# EAGLE design ENERGIS_DispBrd_Rack-PDU_1.1.0 (EAGLE 9.2.1)
VERSION: 1.1.0

## Sheet 1 of 3
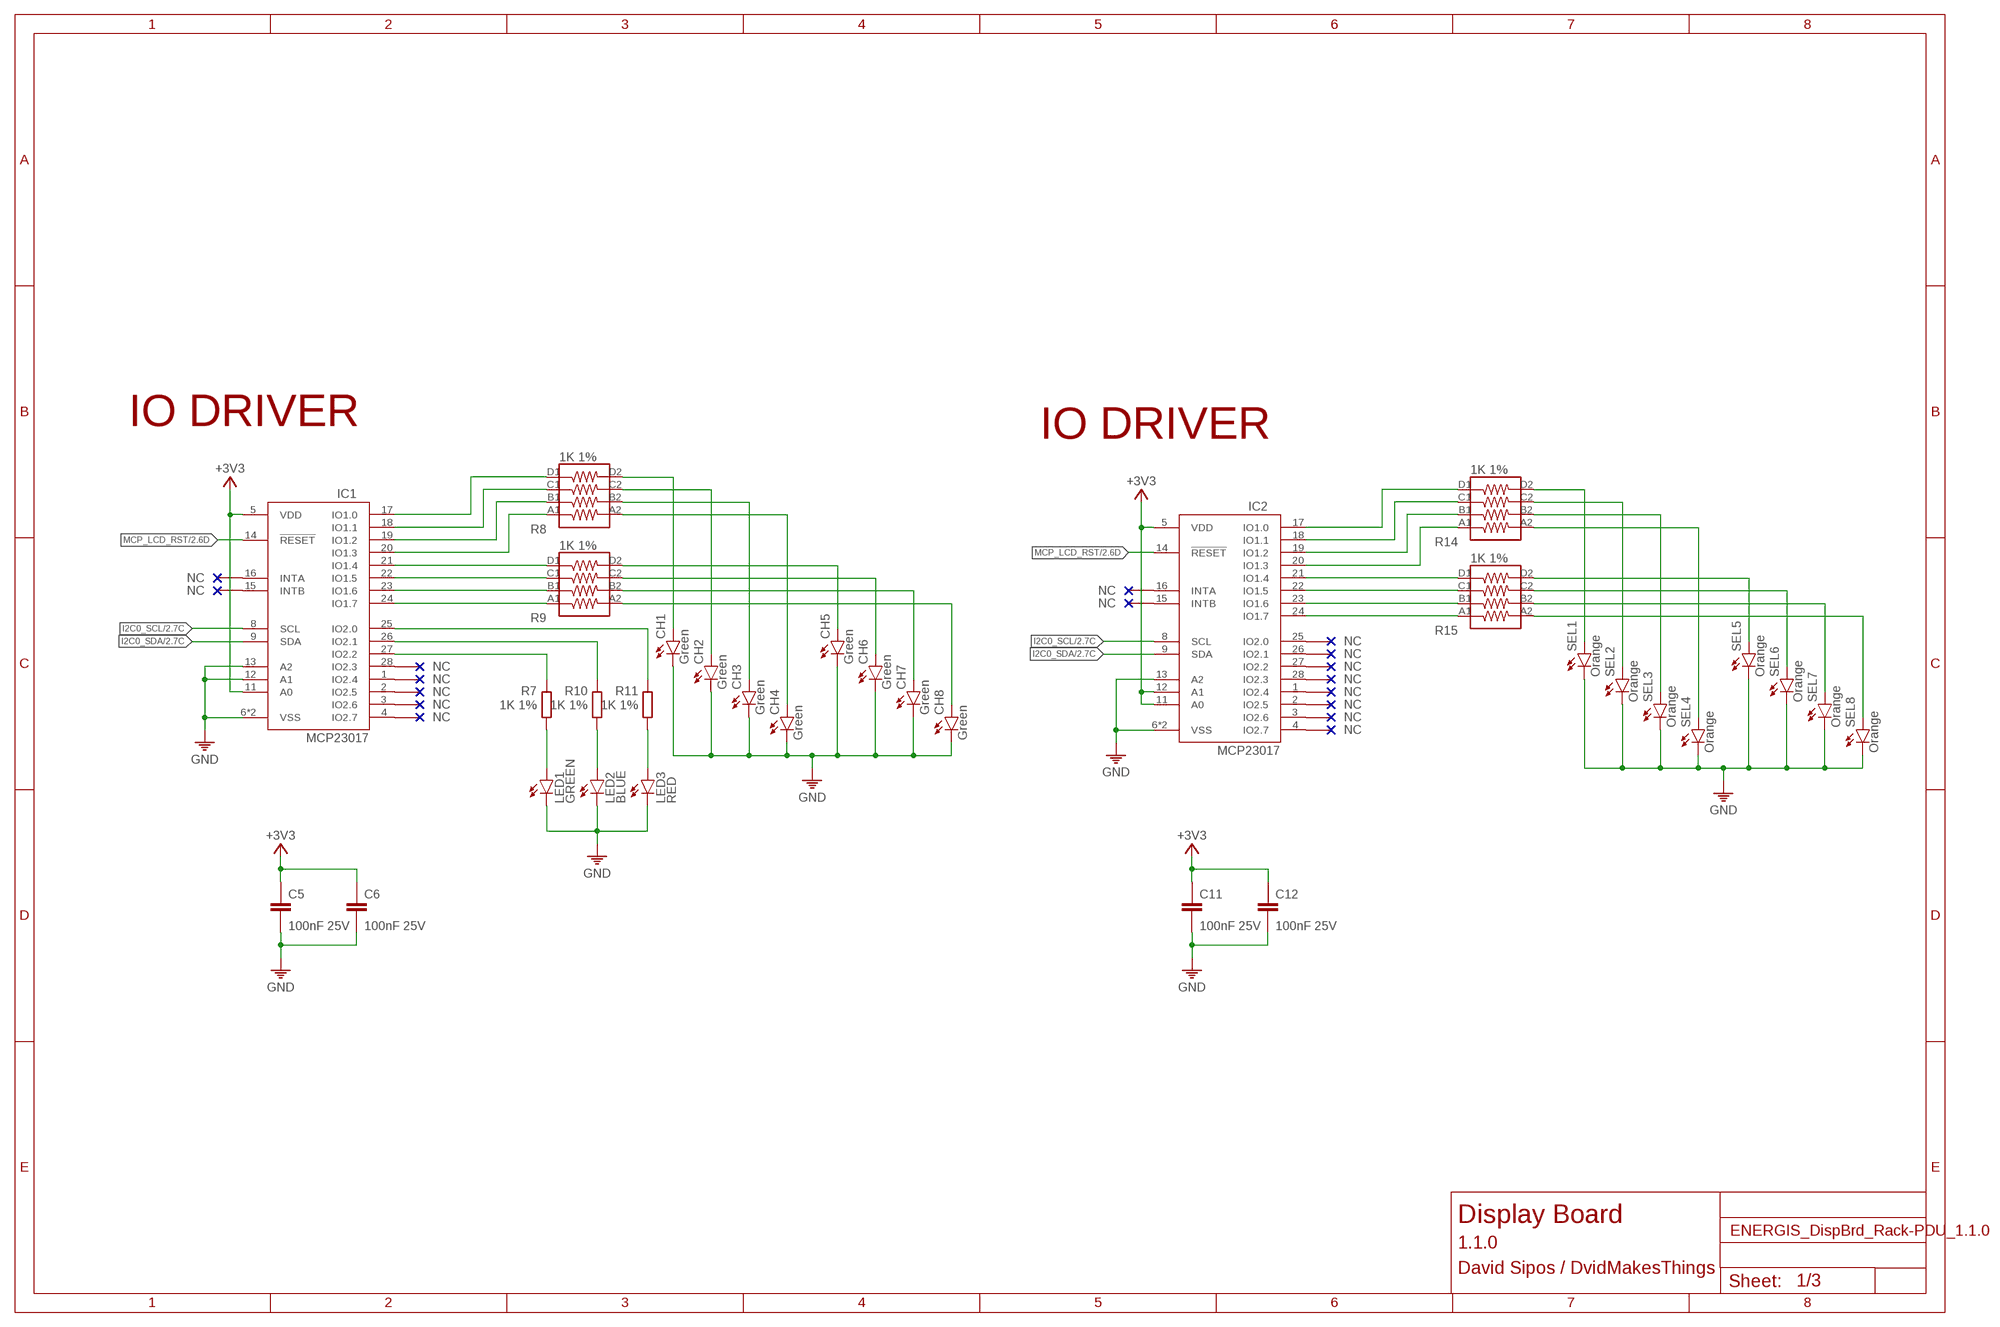
[diagram p0: schematic, sheet 1]

### Parts
C5  100nF 25V  100NF-25V-0402  [0402]
C6  100nF 25V  100NF-25V-0402  [0402]
C11  100nF 25V  100NF-25V-0402  [0402]
C12  100nF 25V  100NF-25V-0402  [0402]
CH1  Green  LED-GREENLED-0805  [LED-0805]
CH2  Green  LED-GREENLED-0805  [LED-0805]
CH3  Green  LED-GREENLED-0805  [LED-0805]
CH4  Green  LED-GREENLED-0805  [LED-0805]
CH5  Green  LED-GREENLED-0805  [LED-0805]
CH6  Green  LED-GREENLED-0805  [LED-0805]
CH7  Green  LED-GREENLED-0805  [LED-0805]
CH8  Green  LED-GREENLED-0805  [LED-0805]
IC1  MCP23017T-E/ML  MCP23017-E/ML  [QFN28[6X6]ML]
IC2  MCP23017T-E/ML  MCP23017-E/ML  [QFN28[6X6]ML]
LED1  GREEN  LED-GREEN3MM-CLEAR  [LED3MM]
LED2  BLUE  LED-BLUE3MM-CLEAR  [LED3MM]
LED3  RED  LED-RED3MM-CLEAR  [LED3MM]
R7  1K 1%  1K-1%0402  [0402]
R8  1K 1%  1K-1%_ARRAY0603X4-1206  [_0603X4-1206]
R9  1K 1%  1K-1%_ARRAY0603X4-1206  [_0603X4-1206]
R10  1K 1%  1K-1%0402  [0402]
R11  1K 1%  1K-1%0402  [0402]
R14  1K 1%  1K-1%_ARRAY0603X4-1206  [_0603X4-1206]
R15  1K 1%  1K-1%_ARRAY0603X4-1206  [_0603X4-1206]
SEL1  Orange  LED-ORANGELED-0805  [LED-0805]
SEL2  Orange  LED-ORANGELED-0805  [LED-0805]
SEL3  Orange  LED-ORANGELED-0805  [LED-0805]
SEL4  Orange  LED-ORANGELED-0805  [LED-0805]
SEL5  Orange  LED-ORANGELED-0805  [LED-0805]
SEL6  Orange  LED-ORANGELED-0805  [LED-0805]
SEL7  Orange  LED-ORANGELED-0805  [LED-0805]
SEL8  Orange  LED-ORANGELED-0805  [LED-0805]

### Nets
+3V3: C5.1 C6.1 C11.1 C12.1 IC1.5(VDD) IC1.11(A0) IC2.5(VDD) IC2.11(A0) IC2.12(A1) ; also sheet 2,3
GND: C5.2 C6.2 C11.2 C12.2 CH1.C CH2.C CH3.C CH4.C CH5.C CH6.C CH7.C CH8.C IC1.6(VSS) IC1.12(A1) IC1.13(A2) IC1.PAD(VSS) IC2.6(VSS) IC2.13(A2) IC2.PAD(VSS) LED1.K(C) LED2.K(C) LED3.K(C) SEL1.C SEL2.C SEL3.C SEL4.C SEL5.C SEL6.C SEL7.C SEL8.C ; also sheet 2,3
I2C0_SCL: IC1.8(SCL) IC2.8(SCL) ; also sheet 2
I2C0_SDA: IC1.9(SDA) IC2.9(SDA) ; also sheet 2
MCP_LCD_RST: IC1.14(!RESET) IC2.14(!RESET) ; also sheet 2
N$8: IC2.17(IO1.0) R14.D1
N$9: IC2.18(IO1.1) R14.C1
N$10: IC2.19(IO1.2) R14.B1
N$11: IC2.20(IO1.3) R14.A1
N$12: IC2.21(IO1.4) R15.D1
N$13: IC2.22(IO1.5) R15.C1
N$14: IC2.23(IO1.6) R15.B1
N$15: IC2.24(IO1.7) R15.A1
N$16: R14.D2 SEL1.A
N$17: R14.C2 SEL2.A
N$18: R14.B2 SEL3.A
N$19: R14.A2 SEL4.A
N$20: R15.D2 SEL5.A
N$21: R15.C2 SEL6.A
N$22: R15.B2 SEL7.A
N$23: R15.A2 SEL8.A
N$46: IC1.26(IO2.1) R10.1
N$47: IC1.27(IO2.2) R7.1
N$48: IC1.25(IO2.0) R11.1
N$50: IC1.17(IO1.0) R8.D1
N$51: IC1.18(IO1.1) R8.C1
N$52: IC1.19(IO1.2) R8.B1
N$53: IC1.20(IO1.3) R8.A1
N$54: IC1.21(IO1.4) R9.D1
N$55: IC1.22(IO1.5) R9.C1
N$56: IC1.23(IO1.6) R9.B1
N$57: IC1.24(IO1.7) R9.A1
N$58: CH1.A R8.D2
N$59: CH2.A R8.C2
N$60: CH3.A R8.B2
N$61: CH4.A R8.A2
N$62: CH5.A R9.D2
N$63: CH6.A R9.C2
N$64: CH7.A R9.B2
N$65: CH8.A R9.A2
N$66: LED3.A R11.2
N$67: LED2.A R10.2
N$68: LED1.A R7.2
Unconnected: IC1.1(IO2.4) IC1.2(IO2.5) IC1.3(IO2.6) IC1.4(IO2.7) IC1.15(INTB) IC1.16(INTA) IC1.28(IO2.3) IC2.1(IO2.4) IC2.2(IO2.5) IC2.3(IO2.6) IC2.4(IO2.7) IC2.15(INTB) IC2.16(INTA) IC2.25(IO2.0) IC2.26(IO2.1) IC2.27(IO2.2) IC2.28(IO2.3)

### Notes on the sheet
- IO DRIVER | IO DRIVER
- Display Board
- David Sipos / DvidMakesThings

## Sheet 2 of 3: CONNECTORS
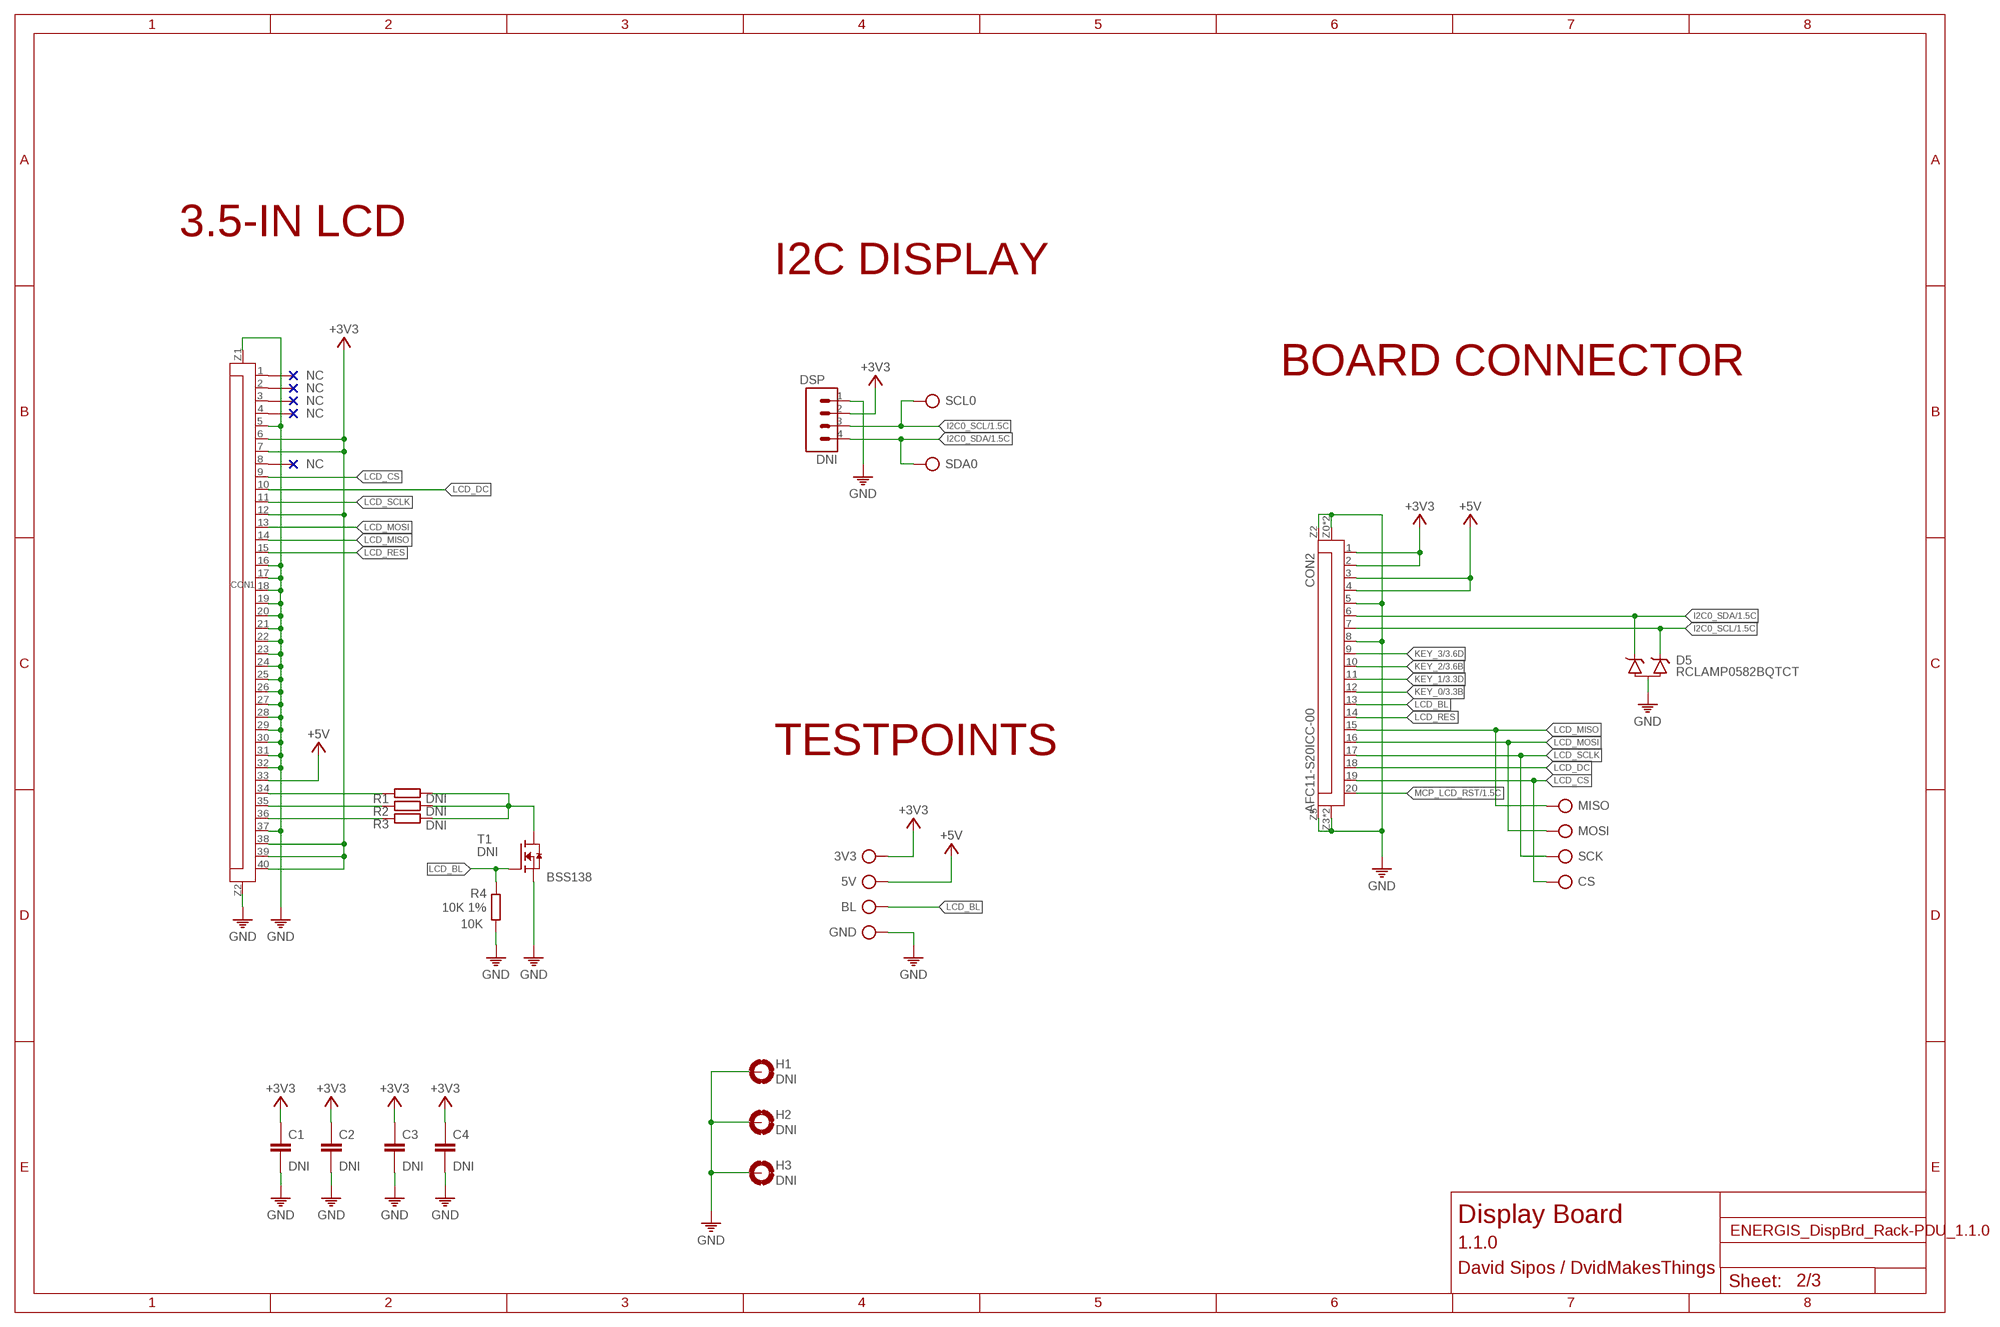
[diagram p1: schematic, sheet 2]

### Parts
3V3  DNI  TP-ROUND  [TP-ROUND]
5V  DNI  TP-ROUND  [TP-ROUND]
BL  DNI  TP-ROUND  [TP-ROUND]
C1  DNI  C-0402  [C0402]
C2  DNI  C-0402  [C0402]
C3  DNI  C-0402  [C0402]
C4  DNI  C-0402  [C0402]
CON1  DNI  FPC40-HD  [FPC40_3.5TFT]
CON2  AFC11-S20ICC-00  AFC11-S20ICC-00  [FPC20]
CS  DNI  TP-ROUND  [TP-ROUND]
D5  RCLAMP0582BQTCT  RCLAMP0582BQTCT-  [SC75]
DSP  DNI  CON-1X4  [1X4]
GND  DNI  TP-ROUND  [TP-ROUND]
H1  DNI  MOUNT-PAD-ROUND3.2  [3,2-PAD]
H2  DNI  MOUNT-PAD-ROUND3.2  [3,2-PAD]
H3  DNI  MOUNT-PAD-ROUND3.2  [3,2-PAD]
MISO  DNI  TP-ROUND  [TP-ROUND]
MOSI  DNI  TP-ROUND  [TP-ROUND]
R1  DNI  R0402  [0402]
R2  DNI  R0402  [0402]
R3  DNI  R0402  [0402]
R4  10K 1%  10K-1%0402  [0402]
SCK  DNI  TP-ROUND  [TP-ROUND]
SCL0  DNI  TP-ROUND  [TP-ROUND]
SDA0  DNI  TP-ROUND  [TP-ROUND]
T1  DNI  BSS138  [SOT23]

### Nets
+3V3: 3V3.TP C1.1 C2.1 C3.1 C4.1 CON1.6 CON1.7 CON1.12 CON1.38 CON1.39 CON1.40 CON2.1 CON2.2 DSP.2 ; also sheet 1,3
+5V: 5V.TP CON1.33 CON2.3 CON2.4
GND: C1.2 C2.2 C3.2 C4.2 CON1.5 CON1.16 CON1.17 CON1.18 CON1.19 CON1.20 CON1.21 CON1.22 CON1.23 CON1.24 CON1.25 CON1.26 CON1.27 CON1.28 CON1.29 CON1.30 CON1.31 CON1.32 CON1.37 CON1.Z1 CON1.Z2 CON2.5 CON2.8 CON2.Z0(Z1) CON2.Z1 CON2.Z2 CON2.Z3 CON2.Z4(Z3) CON2.Z5(Z4) D5.3 DSP.1 GND.TP H1.B3,2(MOUNT) H2.B3,2(MOUNT) H3.B3,2(MOUNT) R4.2 T1.2(S) ; also sheet 1,3
I2C0_SCL: CON2.7 D5.1 DSP.3 SCL0.TP ; also sheet 1
I2C0_SDA: CON2.6 D5.2 DSP.4 SDA0.TP ; also sheet 1
KEY_0: CON2.12 ; also sheet 3
KEY_1: CON2.11 ; also sheet 3
KEY_2: CON2.10 ; also sheet 3
KEY_3: CON2.9 ; also sheet 3
LCD_BL: BL.TP CON2.13 R4.1 T1.1(G)
LCD_CS: CON1.9 CON2.19 CS.TP
LCD_DC: CON1.10 CON2.18
LCD_MISO: CON1.14 CON2.15 MISO.TP
LCD_MOSI: CON1.13 CON2.16 MOSI.TP
LCD_RES: CON1.15 CON2.14
LCD_SCLK: CON1.11 CON2.17 SCK.TP
MCP_LCD_RST: CON2.20 ; also sheet 1
N$2: CON1.35 R2.2
N$3: CON1.36 R3.2
N$4: R1.1 R2.1 R3.1 T1.3(D)
N$5: CON1.34 R1.2
Unconnected: CON1.1 CON1.2 CON1.3 CON1.4 CON1.8

### Notes on the sheet
- 3.5-IN LCD
- I2C DISPLAY
- BOARD CONNECTOR
- TESTPOINTS
- BSS138
- 10K
- Display Board
- David Sipos / DvidMakesThings

## Sheet 3 of 3: PUSHBUTTONS
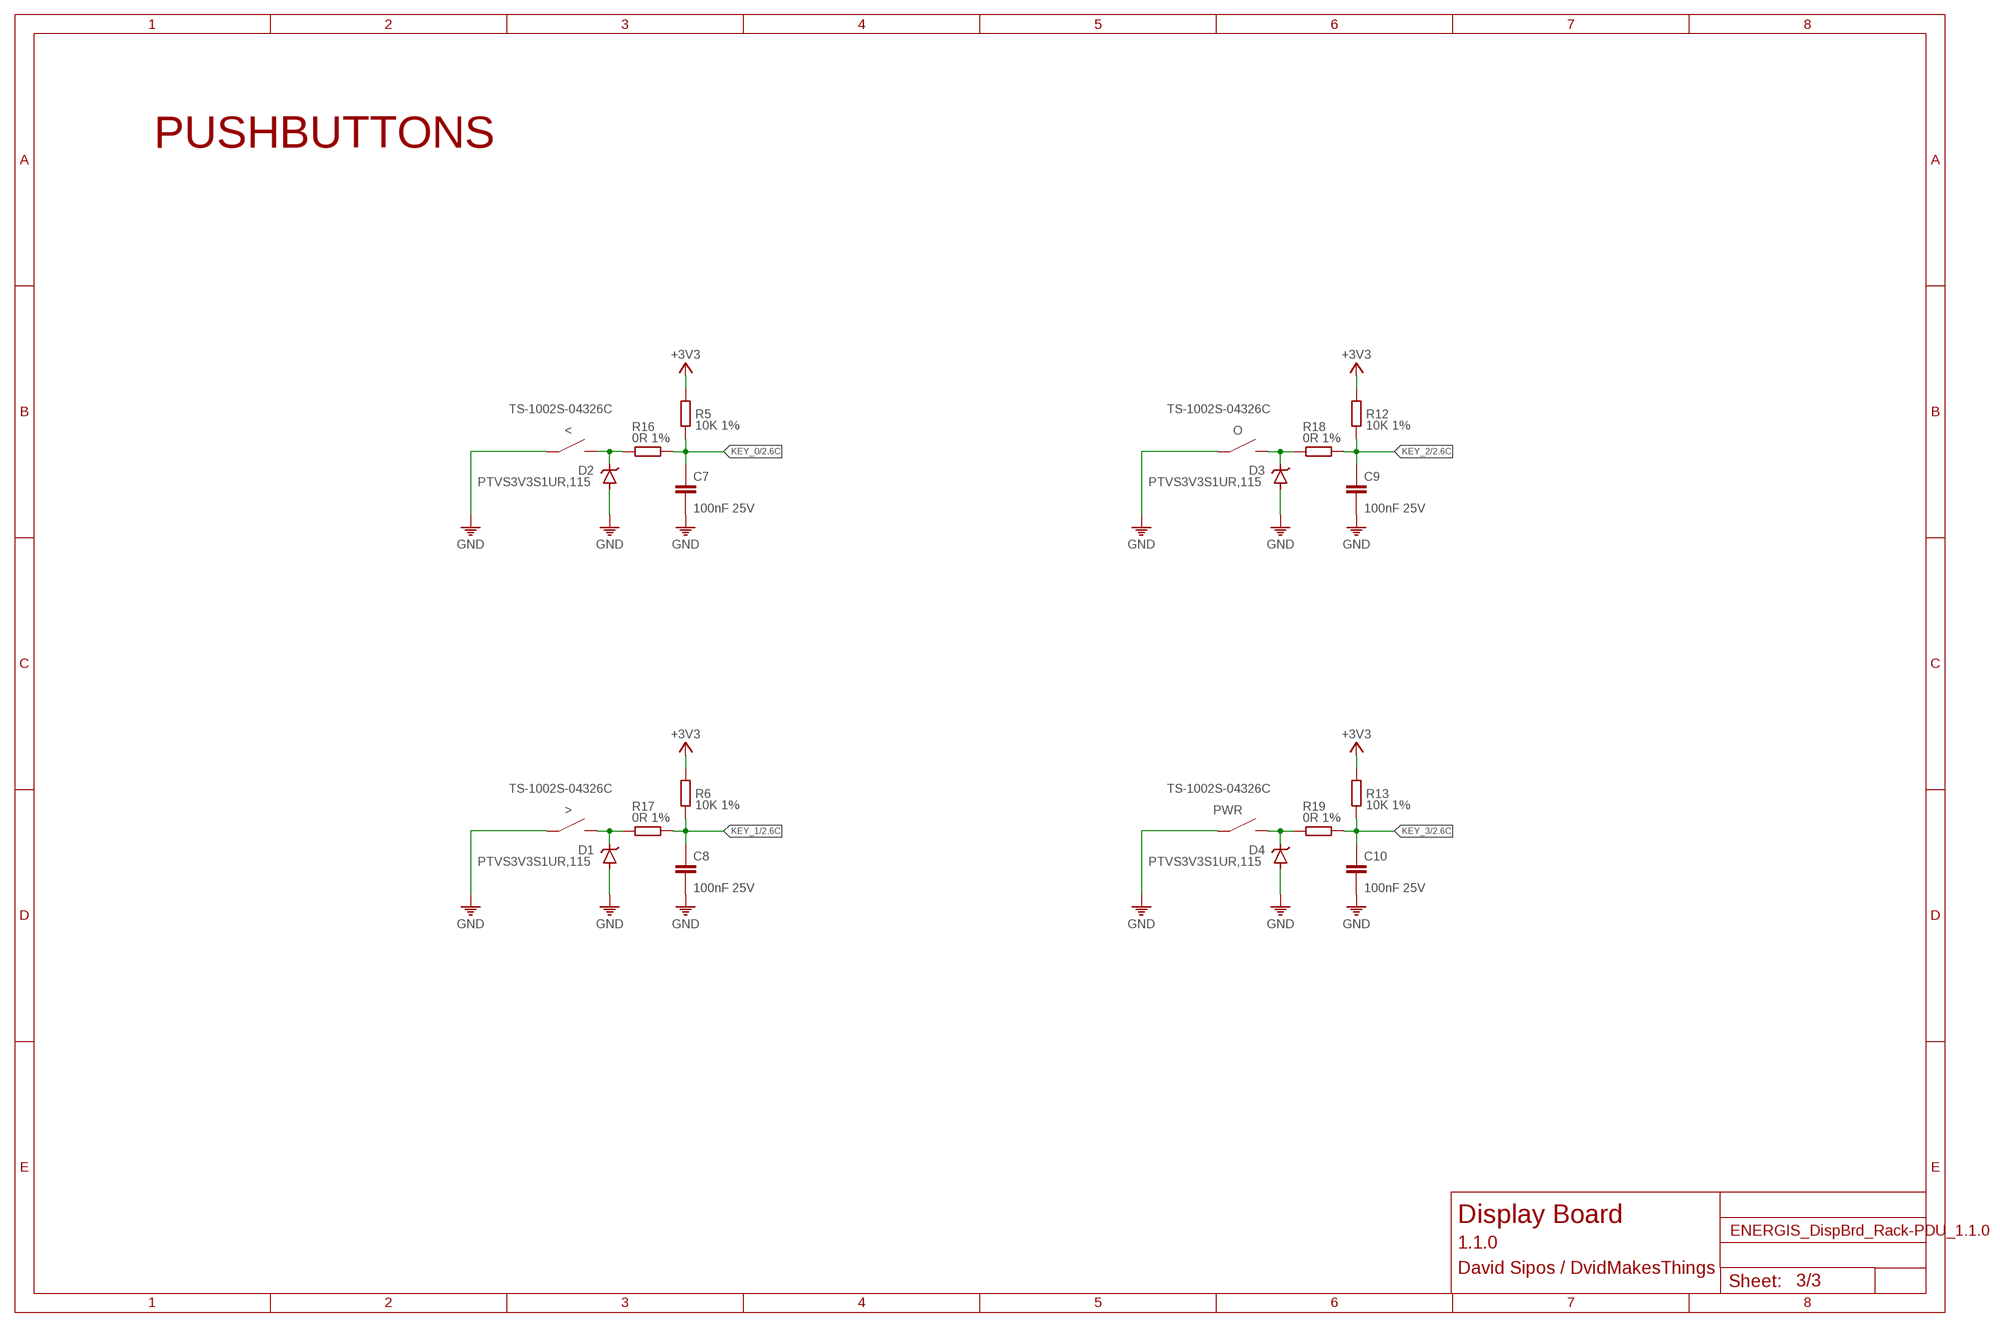
[diagram p2: schematic, sheet 3]

### Parts
<  TS-1002S-04326C  SWITCH6X6-SHORT  [PUSHBUTTON-6X6]
>  TS-1002S-04326C  SWITCH6X6-SHORT  [PUSHBUTTON-6X6]
C7  100nF 25V  100NF-25V-0402  [0402]
C8  100nF 25V  100NF-25V-0402  [0402]
C9  100nF 25V  100NF-25V-0402  [0402]
C10  100nF 25V  100NF-25V-0402  [0402]
D1  PTVS3V3S1UR,115  PTVS3V3S1UR,115  [SOD-123]
D2  PTVS3V3S1UR,115  PTVS3V3S1UR,115  [SOD-123]
D3  PTVS3V3S1UR,115  PTVS3V3S1UR,115  [SOD-123]
D4  PTVS3V3S1UR,115  PTVS3V3S1UR,115  [SOD-123]
O  TS-1002S-04326C  SWITCH6X6-SHORT  [PUSHBUTTON-6X6]
PWR  TS-1002S-04326C  SWITCH6X6-SHORT  [PUSHBUTTON-6X6]
R5  10K 1%  10K-1%0402  [0402]
R6  10K 1%  10K-1%0402  [0402]
R12  10K 1%  10K-1%0402  [0402]
R13  10K 1%  10K-1%0402  [0402]
R16  0R 1%  0R0402  [0402]
R17  0R 1%  0R0402  [0402]
R18  0R 1%  0R0402  [0402]
R19  0R 1%  0R0402  [0402]

### Nets
+3V3: R5.1 R6.1 R12.1 R13.1 ; also sheet 1,2
GND: <.1 <.2 >.1 >.2 C7.2 C8.2 C9.2 C10.2 D1.A D2.A D3.A D4.A O.1 O.2 PWR.1 PWR.2 ; also sheet 1,2
KEY_0: C7.1 R5.2 R16.2 ; also sheet 2
KEY_1: C8.1 R6.2 R17.2 ; also sheet 2
KEY_2: C9.1 R12.2 R18.2 ; also sheet 2
KEY_3: C10.1 R13.2 R19.2 ; also sheet 2
N$7: <.3 <.4 D2.C R16.1
N$24: D3.C O.3 O.4 R18.1
N$25: D4.C PWR.3 PWR.4 R19.1
N$26: >.3 >.4 D1.C R17.1

### Notes on the sheet
- PUSHBUTTONS
- Display Board
- David Sipos / DvidMakesThings

## Library data of the parts
3V3 5V BL CS GND MISO MOSI SCK SCL0 SDA0 = ds_passive:TP; ROHS: YES
< > O PWR = ds_passive:SWITCH; DESCRIPTION: 6mm 4.3mm Round Button 50mA Standing paste 6mm SPST 12V SMD,6x6mm Tactile Switches ROHS; HQ_PART: SW0049370; LCSC_PART: C455108; MANUFACTURER: USAKRO; MPN: UK-B0228G43-SP25; ROHS: YES
C1-C4 = ds_passive:C
C5-C12 = ds_capacitors:100NF-25V; DESCRIPTION: 25V 100nF ±10% 0402 Multilayer Ceramic Capacitors MLCC - SMD/SMT ROHS; HQ_PART: CA0176807; LCSC_PART: C56392; MANUFACTURER: Walsin; MPN: 0402X104K250CT; ROHS: YES
CH1-CH8 = ds_LED:LED-GREEN; DESCRIPTION: Emerald 0805 LED Indication - Discrete ROHS; HQ_PART: PH0094653; LCSC_PART: C2297; MANUFACTURER: MEIHUA; MPN: MHT170UGCT; ROHS: YES
CON1 = ds_con:FPC40-H
CON2 = ds_con:AFC11-S20ICC-00: Drawer Type 20P Single-sided contact points/Vertical Standing paste 0.5mm SMD,P=0.5mm FFC, FPC (Flat Flexible) Connector Assemblies ROHS; DESCRIPTION: Drawer Type 20P Single-sided contact points/Vertical Standing paste 0.5mm SMD,P=0.5mm FFC, FPC (Flat Flexible) Connector Assemblies ROHS; HQ_PART: CO0889517; LCSC_PART: C11073; MANUFACTURER: JS; MPN: AFC11-S20ICA-00; ROHS: YES
D1-D4 = ds_diode:PTVS3V3S1UR,115: 400 W unidirectional Transient Voltage Suppressor (TVS) in a SOD123W small and flat lead low-profile Surface-Mounted Device (SMD) plastic package, designed for transient overvoltage protection.; DATASHEET: https://assets.nexperia.com/documents/data-sheet/PTVSXS1UR_SER.pdf; DESCRIPTION: 3.3V 350W@10/1000us 43.8A@10/1000us 5.6V 5uA 8V IEC 61000-4-2 TVS Unidirectional SOD-123W ESD and Surge Protection (TVS/ESD) ROHS; HQ_PART: CP0009318; LCSC_PART: C183521; MANUFACTURER: Nexperia; MPN: PTVS3V3S1UR,115; ROHS: YES
D5 = ds_diode:RCLAMP0582BQTCT: The RailClamp0582BQ is a 5V, dual-line, low-capacitance automotive-grade RailClamp transient voltage suppressor (TVS) optimized for safeguarding high-speed data ports, such as Ethernet and USB, from electrostatic discharge (ESD) threats. The low-capacitance and high ESD robustness of the RClamp0582BQ make it an ideal protection device for safeguarding automotive-based data lines from harsh ESD spikes.; DATASHEET: https://semtech.my.salesforce.com/sfc/p/#E0000000JelG/a/440000001Lzx/0M5l0VFdFhBLS7TSRfd1I2V77GSkvtksC9b.1bnFtjQ; HQ_PART: PD0007296; LCSC_PART: C841193; MANUFACTURER: SEMTECH; MPN: RCLAMP0582BQTCT; ROHS: YES
DSP = ds_con:CON-1X4
H1-H3 = holes:MOUNT-PAD-ROUND: MOUNTING PAD, round
IC1 IC2 = ds_ic_peripherals:MCP23017: 16-Bit I2C I/O Expander with Serial Interface; DATASHEET: https://ww1.microchip.com/downloads/en/devicedoc/20001952c.pdf; DESCRIPTION: 1.7MHz I2C QFN-28-EP(6x6) I/O Expanders ROHS; HQ_PART: IC0080215; LCSC_PART: C629439; MANUFACTURER: MICROCHIP; MPN: MCP23017-E/ML; ROHS: YES
LED1 = ds_LED:LED-GREEN; DESCRIPTION: -20℃~+80℃ 20mA 30° 3mm Round Lens 600nm~610nm 610nm 72mW Amber Water Clear Plugin,D=3mm LED Indication - Discrete ROHS; HQ_PART: PH0094890; LCSC_PART: C414645; MANUFACTURER: MEIHUA; MPN: MHL3014UGTD; ROHS: YES
LED2 = ds_LED:LED-BLUE; DESCRIPTION: 3mm Round Lens Blue Plugin,D=3mm LED Indication - Discrete ROHS; HQ_PART: PH0094706; LCSC_PART: C86881; MANUFACTURER: MEIHUA; MPN: MHL3014UBTD; ROHS: YES
LED3 = ds_LED:LED-RED; DESCRIPTION: -20℃~+80℃ 20mA 30° 3mm Round Lens Red Water Clear Plugin,D=3mm LED Indication - Discrete ROHS; HQ_PART: PH0094690; LCSC_PART: C330752; MANUFACTURER: MEIHUA; MPN: MHL3014SRTS; ROHS: YES
R1-R3 = ds_passive:R
R4-R6 R12 R13 = ds_resistor:10K-1%; DESCRIPTION: 62.5mW Thick Film Resistors 50V ±100ppm/℃ ±1% 10kΩ 0402 Chip Resistor - Surface Mount ROHS; HQ_PART: RE0207399; LCSC_PART: C25744; MANUFACTURER: ROHM; MPN: MCR01MZPF1002; ROHS: YES
R7 R10 R11 = ds_resistor:1K-1%; DESCRIPTION: 62.5mW Thick Film Resistors 50V ±100ppm/℃ ±1% 1kΩ 0402 Chip Resistor - Surface Mount ROHS; HQ_PART: RE0208724; LCSC_PART: C11702; MANUFACTURER: FH; MPN: RC-02K1001FT; ROHS: YES
R8 R9 R14 R15 = ds_resistor:1K-1%_ARRAY; DESCRIPTION: 4 ±1% 1kΩ 62.5mW ±200ppm/℃ 0603x4 Resistor Networks, Arrays ROHS; HQ_PART: RE0022532; LCSC_PART: C110021; MANUFACTURER: Yageo; MPN: YC164-JR-071KL; ROHS: YES
R16-R19 = ds_resistor:0R; DESCRIPTION: 62.5mW Thick Film Resistors 50V ±800ppm/℃ ±1% 0Ω 0402 Chip Resistor - Surface Mount ROHS; HQ_PART: RE0250181; LCSC_PART: C17168; MANUFACTURER: YAGEO; MPN: RC0402JR-130RL; ROHS: YES
SEL1-SEL8 = ds_LED:LED-ORANGE; DESCRIPTION: 10mA Colorless transparent lens -40℃~+85℃ 598nm~608nm Orange 120° 40mW 0805 LED Indication - Discrete ROHS; HQ_PART: PH0093712; LCSC_PART: C434437; MANUFACTURER: NATIONSTAR; MPN: FC-2012YOXK(5)-600H08; ROHS: YES
T1 = ds_active:BSS138; DESCRIPTION: 50V 230mA 3.4Ω@10V,220mA 230mW 1.5V@250uA N Channel SOT-23-3 MOSFETs ROHS; HQ_PART: DS0190318; MANUFACTURER: HUASHUO; MPN: BSS138; ROHS: YES; VALUE: BSS138

## Net classes
0 default: width 0.173 mm, drill 0.35 mm, clearance 0.191 mm

## Board
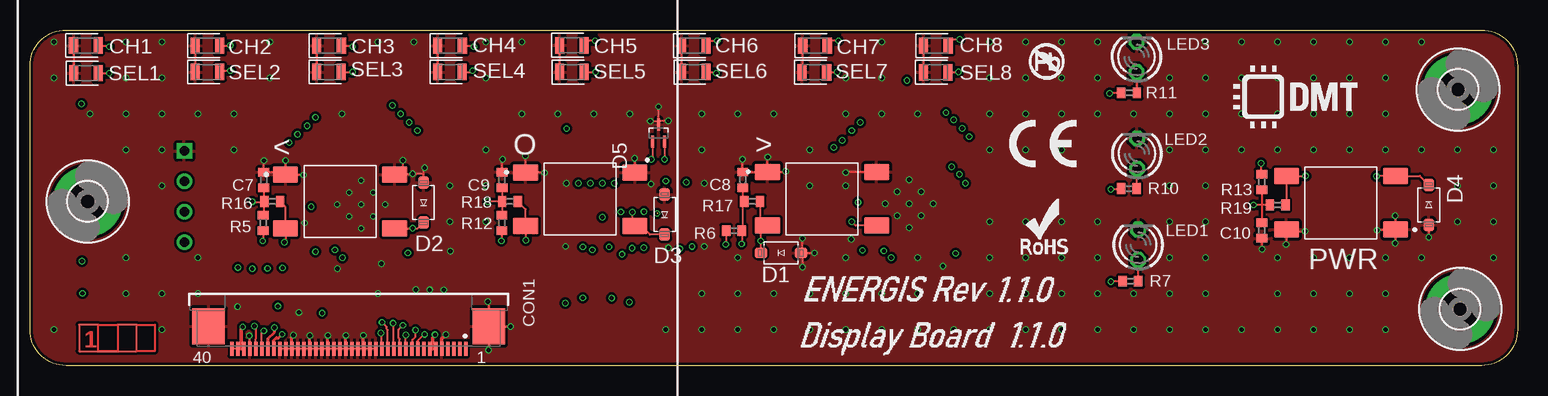
[diagram p3: board, top side]
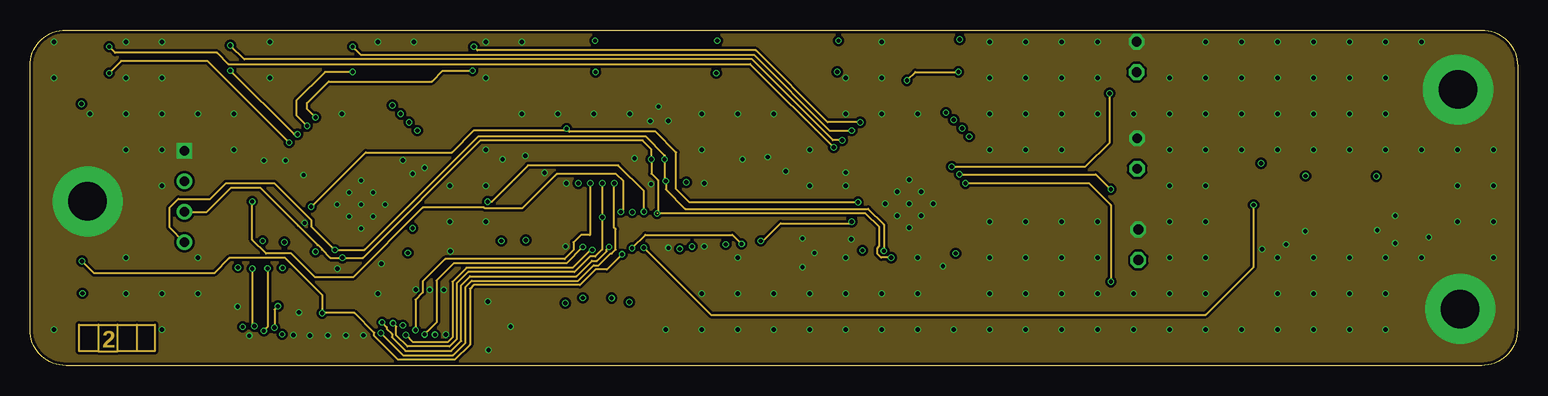
[diagram p4: board, inner layer Route2]
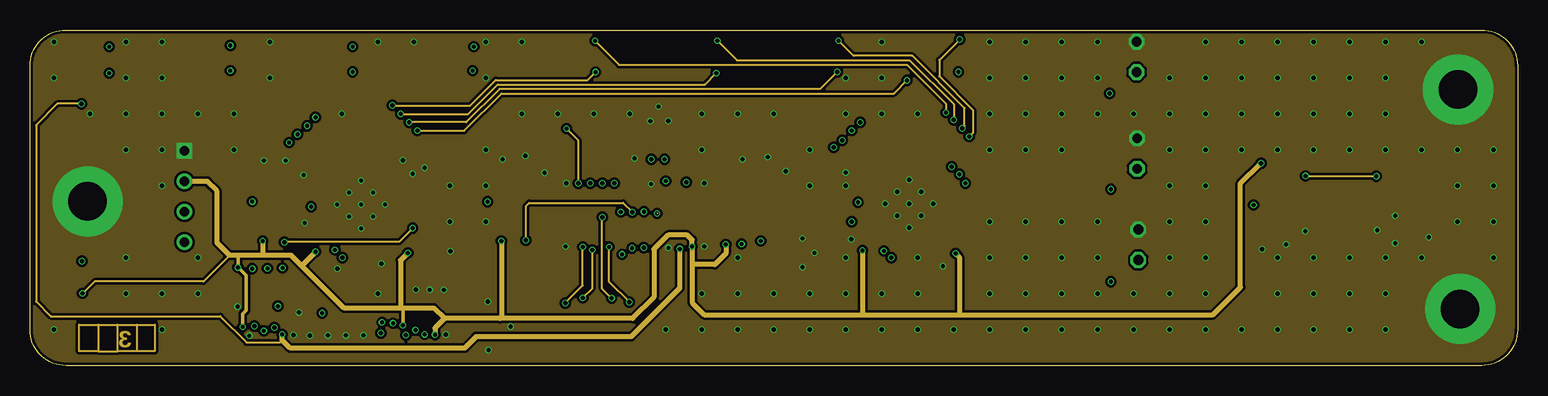
[diagram p5: board, inner layer Route15]
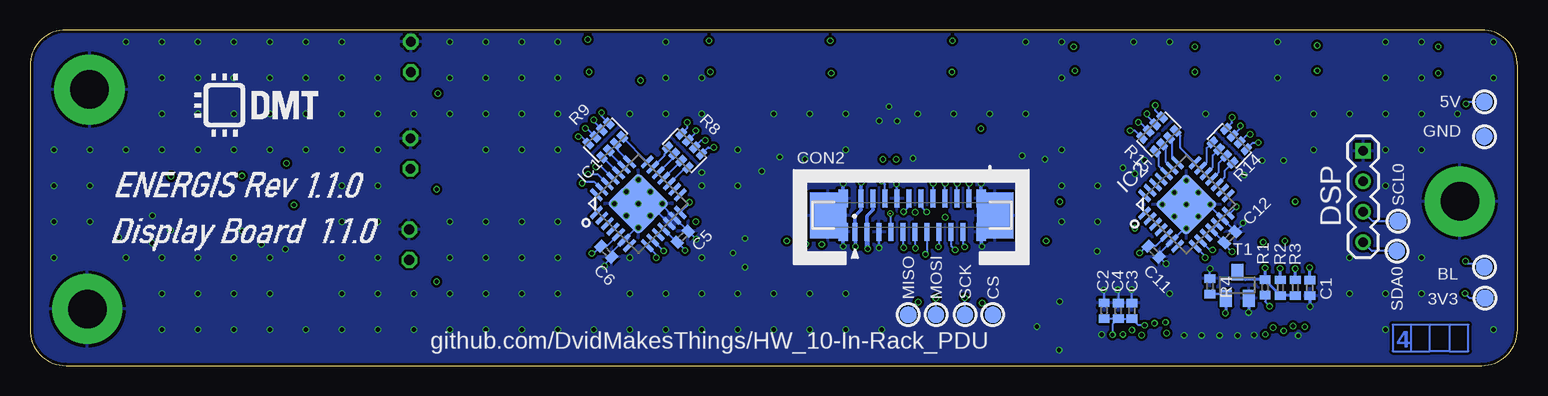
[diagram p6: board, bottom side, seen from below]

Size 124 x 28 mm. Coordinates in mm from the lower left corner, seen from the top.
Outline: 3,28 121,28 arc-90 124,25 124,3 arc-90 121,0 3,0 arc-90 0,3 0,25 arc-90 3,28
Copper layers (1+2*15+16): Top 0.035mm / dielectric 0.125mm / Route2 0.018mm / dielectric 1.194mm / Route15 0.018mm / dielectric 0.125mm / Bottom 0.035mm
Design rules "Huaqiu04161H01-2116-4layers": minimum track width 3mil, minimum drill 0.2mm, track to track 3mil, track to pad 4mil, pad to pad 0.15mm, via to via 12mil, smd to smd 0.15mm, copper to edge 0.2mm, drill to drill 6mil, minimum pad ring 3.5mil, minimum via ring 3.5mil, stop-mask expansion 1.5mil, vias tented up to drill 16mil, thermal gap 10mil

### Footprints (pad centres in the part's own frame; a part is rotated, then mirrored left to right if it is on the bottom)
TP-ROUND = smd 1.4 x 1.4: TP 0,0
PUSHBUTTON-6X6 = smd 2.1 x 1.38: 1 -4.55,2.24; 2 4.55,2.24; 3 -4.55,-2.24; 4 4.55,-2.24
C0402 = smd 0.7 x 0.9: 1 -0.65,0; 2 0.65,0
0402 = smd 0.7 x 0.9: 1 -0.65,0; 2 0.65,0
LED-0805 = smd 0.762 x 1.362: A 1.025,0; C -1.025,0
FPC40_3.5TFT = smd 1.2 x 0.3: 1 24.191,10.261; 2 24.191,9.761; 3 24.191,9.261; 4 24.191,8.761; 5 24.191,8.261; 6 24.191,7.761; 7 24.191,7.261; 8 24.191,6.761; 9 24.191,6.261; 10 24.191,5.761; 11 24.191,5.261; 12 24.191,4.761; 13 24.191,4.261; 14 24.191,3.761; 15 24.191,3.261; 16 24.191,2.761; 17 24.191,2.261; 18 24.191,1.761; 19 24.191,1.261; 20 24.191,0.761; 21 24.191,0.261; 22 24.191,-0.239; 23 24.191,-0.739; 24 24.191,-1.239; 25 24.191,-1.739; 26 24.191,-2.239; 27 24.191,-2.739; 28 24.191,-3.239; 29 24.191,-3.739; 30 24.191,-4.239; 31 24.191,-4.739; 32 24.191,-5.239; 33 24.191,-5.739; 34 24.191,-6.239; 35 24.191,-6.739; 36 24.191,-7.239; 37 24.191,-7.739; 38 24.191,-8.239; 39 24.191,-8.739; 40 24.191,-9.239 | smd 3 x 2.7: Z1 22.331,12.191; Z2 22.331,-11.169
FPC20 = smd 0.4 x 1.5: 1 -4.552,-1.362; 2 -4.052,1.438; 3 -3.552,-1.362; 4 -3.052,1.438; 5 -2.552,-1.362; 6 -2.052,1.438; 7 -1.552,-1.362; 8 -1.052,1.438; 9 -0.552,-1.362; 10 -0.052,1.438; 11 0.448,-1.362; 12 0.948,1.438; 13 1.448,-1.362; 14 1.948,1.438; 15 2.448,-1.362; 16 2.948,1.438; 17 3.448,-1.362; 18 3.948,1.438; 19 4.448,-1.362; 20 4.948,1.438 | smd 3.048 x 3.81: Z0 -6.795,0; Z5 7.112,0 | smd 0.8 x 1.5: Z1 -5.552,-1.362; Z2 -5.552,1.438; Z3 5.948,-1.362; Z4 5.948,1.438
SOD-123 = smd 1.02 x 0.86: A 1.68,0; C -1.68,0
SC75 = smd 0.99 x 0.3: 1 -0.72,0.5; 2 -0.72,-0.5; 3 0.72,0
1X4 = drill 0.8 square: 1 0,3.81 | drill 0.8: 2 0,1.27; 3 0,-1.27; 4 0,-3.81
3,2-PAD = drill 3.2 pad 5.842: B3,2 0,0
QFN28[6X6]ML = smd 1.27 x 0.35: 1 -2.985,1.95; 2 -2.985,1.3; 3 -2.985,0.65; 4 -2.985,0; 5 -2.985,-0.65; 6 -2.985,-1.3; 7 -2.985,-1.95; 15 2.985,-1.95; 16 2.985,-1.3; 17 2.985,-0.65; 18 2.985,0; 19 2.985,0.65; 20 2.985,1.3; 21 2.985,1.95 | smd 0.35 x 1.27: 8 -1.95,-2.985; 9 -1.3,-2.985; 10 -0.65,-2.985; 11 0,-2.985; 12 0.65,-2.985; 13 1.3,-2.985; 14 1.95,-2.985; 22 1.95,2.985; 23 1.3,2.985; 24 0.65,2.985; 25 0,2.985; 26 -0.65,2.985; 27 -1.3,2.985; 28 -1.95,2.985 | smd 3.7 x 3.7: PAD 0,0
LED3MM = drill 0.813 octagon: A -1.27,0; K 1.27,0
_0603X4-1206 = smd 0.59 x 0.92: A1 -1.2,-0.8; A2 -1.2,0.8; B1 -0.4,-0.8; B2 -0.4,0.8; C1 0.4,-0.8; C2 0.4,0.8; D1 1.2,-0.8; D2 1.2,0.8
SOT23 = smd 1 x 1.4: 1 -0.95,-1.1; 2 0.95,-1.1; 3 0,1.1

### Placement (x,y rotation side)
3V3  2.71,5.62 180 bottom
5V  2.76,22 0 bottom
<  25.85,13.69 0 top
>  66.03,13.91 0 top
BL  2.77,8.21 0 bottom
C1  17.32,6.48 270 bottom
C2  34.45,4.58 90 bottom
C3  32.15,4.56 90 bottom
C4  33.28,4.56 90 bottom
C5  69.6,10.75 45 bottom
C6  75.96,9.51 315 bottom
C7  19.49,15.48 90 top
C8  59.41,15.5 90 top
C9  39.35,15.48 90 top
C10  102.68,11.27 270 top
C11  30.33,9.51 315 bottom
C12  23.98,10.71 45 bottom
CH1  4.65,26.71 0 top
CH2  14.8,26.69 0 top
CH3  24.93,26.69 0 top
CH4  35.02,26.69 0 top
CH5  45.16,26.71 0 top
CH6  55.32,26.69 0 top
CH7  65.44,26.68 0 top
CH8  75.52,26.68 0 top
CON1  26.06,25.59 270 top
CON2  50.67,12.52 0 bottom
CS  43.73,4.24 90 bottom
D1  62.6,9.4 0 top
D2  32.8,13.6 90 top
D3  52.9,12.6 90 top
D4  116.6,13.4 270 top
D5  52.4,19.4 90 top
DSP  12.87,14.1 0 bottom
GND  2.76,19.1 0 bottom
H1  4.8,13.69 0 top
H2  119.04,23.03 0 top
H3  119.22,4.71 0 top
IC1  73.29,13.5 45 bottom
IC2  27.61,13.44 45 bottom
LED1  92.39,10.08 90 top
LED2  92.29,17.68 90 top
LED3  92.25,25.75 90 top
MISO  50.79,4.24 90 bottom
MOSI  48.47,4.24 90 bottom
O  45.87,13.88 0 top
PWR  109.29,13.58 180 top
R1  21.04,6.52 270 bottom
R2  19.77,6.5 90 bottom
R3  18.52,6.5 90 bottom
R4  DNI  [0402]  25.64,6.61 90 bottom
R5  19.45,11.9 90 top
R6  58.68,11.25 0 top
R7  91.74,7.04 0 top
R8  69.44,17.93 315 bottom
R9  76.03,18.8 45 bottom
R10  91.6,14.76 0 top
R11  91.62,22.75 0 top
R12  39.34,11.9 90 top
R13  102.68,15.32 270 top
R14  24.02,18.34 315 bottom
R15  29.91,19.29 45 bottom
R16  20.2,13.7 180 top
R17  60.2,13.7 180 top
R18  40,13.7 180 top
R19  104,13.4 180 top
SCK  46.05,4.24 90 bottom
SCL0  9.96,12.04 90 bottom
SDA0  10.06,9.56 270 bottom
SEL1  4.67,24.4 0 top
SEL2  14.8,24.5 0 top
SEL3  24.92,24.5 0 top
SEL4  35,24.5 0 top
SEL5  45.17,24.49 0 top
SEL6  55.33,24.49 0 top
SEL7  65.39,24.47 0 top
SEL8  75.49,24.47 0 top
T1  23.35,6.7 0 bottom
U$1  DNI  [DMT]  107.83,21.69 0 bottom
U$5  DNI  [DMT]  102.77,22.38 0 top
U$8  DNI  [CE-4MM]  81.61,16.49 0 top
U$9  DNI  [ROHS_LOGO_0.18_IN]  82.41,9.18 0 top
U$10  DNI  [NO_PB_LOGO_0.120]  83.03,23.47 0 top

### Tracks (layer width: path | path; a pad name or v marks a point on that pad's centre or on a via)
+3V3  (via drill 0.35)
  Top 0.173: R6.1 58,11.21 v58,10.11 | R12.1 39.3,11.21 v39.3,10.4 | R5.1 19.45,10.45 v19.4,10.4 | CON1.7 33.56,1.4 CON1.6 | CON1.12 30.82,2.21 30.74,2.29 30.74,3.01 v31.09,3.36 | CON1.38 17.6,1.4 CON1.39 CON1.40 | R13.1 102.63,16.02 v102.63,16.87
  Top 0.305: 33.56,1.4 33.56,2.31 33.76,2.51 v33.76,2.57 | 17.6,1.4 17.6,3.11 v17.73,3.23
  Route15 0.173: v4.38,6.02 5.38,7.02 14.46,7.02 16.64,9.2
  Route15 0.305: v17.73,3.23 17.73,4.32 18,4.6 18,7.52 v17.34,8.18 17.34,9.16 17.3,9.2 | v31.09,3.36 31.09,4.59 30.89,4.79
  Route15 0.406: 39.18,3.92 50.24,3.92 52.02,5.7 52.02,9.71 53.2,10.89 54.79,10.89 55.19,10.49 v55.19,9.93 55.19,8.43 55.2,8.43 | 39.18,3.92 34.55,3.92 | v33.76,2.57 33.76,3.13 34.55,3.92 | v39.3,10.4 39.3,4.04 39.18,3.92 | 55.2,8.43 55.2,5.24 56.2,4.24 69.46,4.24 | 69.46,4.24 77.46,4.24 | 77.46,4.24 98.61,4.24 100.91,6.54 100.91,15.21 102.57,16.87 v102.63,16.87 | v58,10.11 58,9.34 57.09,8.43 55.2,8.43 | v77.16,9.35 77.46,9.05 77.46,4.24 | v69.4,9.6 69.4,4.3 69.46,4.24 | 34.55,3.92 33.68,4.79 30.89,4.79 | 22.62,8.37 26.2,4.79 30.89,4.79 | 22.62,8.37 21.79,9.2 19.34,9.2 | 19.34,9.2 17.3,9.2 16.64,9.2 15.6,10.24 15.6,14.56 14.79,15.37 DSP.2 | v19.4,10.4 19.4,9.26 19.34,9.2 | v23.8,9.5 22.67,8.37 22.62,8.37 | v31.5,9.4 30.89,8.79 30.89,4.79
  Bottom 0.173: IC1.11 70.08,10.29 C5.1 69.4,9.64 v69.4,9.6 | IC1.5 75.9,9.97 C6.1 77.04,9.35 v77.16,9.35 | IC2.12 IC2.11 24.44,10.27 C12.1 24.44,10.14 v23.8,9.5 | IC2.5 30.16,9.97 C11.1 30.93,9.97 v31.5,9.4 | C4.1 C3.1 31.6,3.36 v31.09,3.36 | C4.1 33.76,3.43 v33.76,2.57 | C4.1 34.43,3.91 C2.1 | 3V3.TP 3.98,5.62 v4.38,6.02
  Bottom 0.254: C1.1 17.32,8.16 v17.34,8.18
  Bottom 0.305: v54.7,15.3 54.72,15.28 CON2.2 54.72,12.98 55.22,12.48 CON2.1 55.19,11.13 v55.19,9.93
+5V  (via drill 0.35)
  Top 0.254: v21.02,2.6 20.74,2.32 20.54,2.32 20.32,2.1 CON1.33
  Route15 0.173: v4.29,21.84 2.29,21.84 0.5,20.05 0.5,5.35 1.73,4.12 15.87,4.12 18.05,1.94 20.84,1.94 21.02,2.12
  Route15 0.406: v54.16,9.74 54.16,6.45 50.11,2.4 37.18,2.4 36.23,1.45 21.69,1.45 21.02,2.12 v21.02,2.6
  Bottom 0.173: 5V.TP 4.13,22 v4.29,21.84
  Bottom 0.305: CON2.4 53.72,12.98 54.22,12.48 CON2.3
  Bottom 0.406: CON2.3 54.22,9.8 v54.16,9.74
GND  (via drill 0.35)
  Top 0.173: CH1.C 3.63,24.42 SEL1.C | CH2.C SEL2.C | CH3.C SEL3.C | CH4.C 33.99,24.52 SEL4.C | CH5.C 44.13,24.5 SEL5.C | CH6.C 54.29,24.5 SEL6.C | CH7.C 64.41,24.52 SEL7.C | CH8.C 74.49,24.5 SEL8.C | D4.A v116.6,10.7 | v113.8,12.5 113.84,12.46 PWR.1 113.8,11.3 | 113.8,11.3 v113.8,10.2 | v104.7,10.1 104.74,10.14 PWR.2 104.88,11.2 v106.3,11.2 | 113.8,11.3 v112.3,11.3 | C10.2 102.67,9.73 v102.7,9.7 | >.2 68.05,16.15 v68,16.1 | >.1 61.53,16.2 v63,16.2 | >.1 61.48,17.38 v61.5,17.4 | v59.4,17.2 59.41,17.19 C8.2 >.1 | D1.A v65.4,9.4 | D1.A 64.4,9.52 v64.4,10.6 | D1.A 64.4,9.28 v64.4,8.2 | O.2 50.42,17.28 v50.4,17.3 | 52.38,20.4 D5.3 52.4,20.38 | v53.2,20.41 v53.21,20.41 52.43,20.41 52.4,20.38 | 52.4,20.38 v52.4,21.6 | O.1 41.3,16.14 | 41.3,16.14 v41.3,17.5 | 41.3,16.14 42.84,16.14 v42.89,16.09 | C9.2 39.35,17.15 v39.4,17.2 | D2.A 32.8,16 | 32.8,16 32.8,16.4 v32.9,16.5 | <.2 30.6,16.13 | 30.6,16.13 31.09,16.62 v31.09,17.13 | 30.6,16.13 30.73,16 v31.9,16 32.8,16 | 21.3,16 <.1 22.77,15.93 v22.8,15.9 | 21.3,16 v21.3,17.1 | 21.3,16 21.17,16.13 C7.2 19.49,17.09 v19.5,17.1 | CON1.Z1 38.25,5.25 v38.17,5.33 | CON1.Z1 v40.05,3.26 v40.06,3.25 | CON1.Z1 38.25,1.33 v38.22,1.3 | CON1.16 CON1.17 CON1.18 CON1.19 CON1.20 CON1.21 CON1.22 CON1.23 CON1.24 CON1.25 CON1.26 CON1.27 CON1.28 CON1.29 CON1.30 CON1.31 CON1.32 | CON1.37 18.32,2.45 v18.28,2.49 | v51.7,20.4 52.38,20.4 52.4,20.38
  Top 0.254: CON1.30 21.82,2.41 v21.96,2.55 | CON1.27 v23.32,2.49 v23.33,2.5 | CON1.24 v24.82,2.5 v24.83,2.51 | CON1.21 v26.32,2.5 v26.33,2.51 | CON1.18 27.79,1.43 v27.79,2.52
  Top 0.305: CON1.5 34.32,2.24 v34.66,2.58
  Bottom 0.173: IC1.13 69.16,11.21 C5.2 68.48,10.55 v68.45,10.55 | IC1.13 IC1.12 72.37,13.5 | IC1.13 71.45,13.5 72.37,13.5 | 72.37,13.5 73.19,13.5 | 73.19,13.5 IC1.PAD | v76.1,8.3 76.1,8.45 C6.2 75.5,9.45 IC1.6 73.19,11.76 73.19,13.5 | v22.9,11.9 22.9,11.79 C12.2 23.52,11.19 IC2.13 25.74,13.41 27.61,13.41 | v29.3,8.5 29.32,8.5 C11.2 29.87,9.34 IC2.6 27.61,11.6 27.61,13.41 | CON2.8 51.72,15.1 v51.77,15.15 | C2.2 34.45,6.26 v34.5,6.31 | v33.32,6.32 33.28,6.28 C4.2 | C3.2 v32.16,6.34 | R4.2 v25.63,8.09 | CON2.5 v53.22,9.82 | 27.61,13.41 IC2.PAD
  Bottom 0.254: C1.2 17.32,4.94 v17.3,4.92 | T1.2 v22.4,4.44 v22.41,4.43
  Bottom 0.305: CON2.Z2 56.22,15.18 v56.2,15.2 | CON2.Z1 56.22,9.96 v56.2,9.94 | CON2.Z4 44.72,15.18 v44.7,15.2 | CON2.Z3 44.68,11.12 44.68,9.98 v44.64,9.94
  other vias: 27.61,13.44 26.61,14.44 27.61,15.44 28.61,14.44 29.61,13.44 28.61,12.44 27.61,11.44 26.61,12.44 25.61,13.44 73.29,13.5 72.29,14.5 73.29,15.5 74.29,14.5 75.29,13.5 74.29,12.5 73.29,11.5 72.29,12.5 71.29,13.5 2,24 2,27 5,21 8,21 11,21 14,21 17,21 17,18 11,15 11,18 8,18 2,3 11,3 11,6 8,6 8,9 14,9 20,24 20,27 29,27 32,27 38,27 41,27 38,24 26,21 41,21 44,21 47,21 50,21 38,18 35,15 38,15 35,12 38,12 35.04,9.54 29,6 14,6 53,3 56,3 59,3 8,24 11,24 11,27 8,27 62,3 65,3 56,6 59,6 62,6 65,6 68,6 68,3 68,9 74,9 74,6 71,6 80,6 83,6 86,6 89,6 89,3 86,3 83,3 80,3 77,3 74,3 71,3 92,3 92,6 89,9 86,9 83,9 80,9 80,12 83,12 86,12 89,12 80,18 80,21 74,21 71,21 68,21 68,24 71,24 71,27 80,27 80,24 83,27 83,24 86,27 86,24 86,21 83,21 83,18 86,18 89,21 89,24 89,27 95,24 95,21 92,21 98,21 98,24 98,27 101,27 104,27 107,27 110,27 113,27 113,24 113,21 110,21 113,18 110,18 107,18 104,18 101,18 98,18 95,18 101,21 104,21 107,21 116,18 116,27 119,18 122,18 122,15 119,15 119,12 122,12 122,9 116,9 113,9 113,6 110,6 107,6 104,6 104,9 107,9 110,9 98,9 95,9 95,12 98,12 95,15 98,15 98,6 95,6 95,3 98,3 101,3 104,3 107,3 110,3 113,3 56,21 56,18 59,21 62,21 65,18 59,9 65,15 68,15 101,24 104,24 107,24 110,24
  pour Bottom (isolate 0.203): -4.6,31.88 130.7,31.88 130.7,-4.39 -4.6,-4.39
  pour Top (isolate 0.203): -1.5,29.55 126.65,29.55 126.65,-1.14 -1.5,-1.14
  pour Route15 (isolate 0.203, no thermals): -3.6,30.88 129.2,30.88 129.2,-3.09 -3.6,-3.09
  pour Route2 (isolate 0.203, no thermals): -2.7,30.08 127.9,30.08 127.9,-2.19 -2.7,-2.19
I2C0_SCL  (via drill 0.35)  (1 unrouted)
  Top 0.173: D5.1 51.9,17.3 v51.8,17.2
  Route2 0.173: v52.27,12.69 | v71.8,9 v71.79,9.01 70.95,9.01 70.63,9.33 70.63,9.79 70.8,9.96 70.8,11.55 69.66,12.69 52.34,12.69 52.34,15.46 51.8,16 v51.8,17.2 51.8,18.04 51.06,18.78 37.53,18.78 27.75,9 v26.04,9 25.03,9 24.35,9.68 24.35,9.73 24.03,10.05 23.96,10.05 22.35,11.67 22.35,11.68 19.18,14.85 16.75,14.85 14.73,12.83 DSP.3
  Bottom 0.173: CON2.7 52.22,12.64 v52.27,12.69 | SCL0.TP 12.08,12.04 DSP.3 | IC2.8 26.04,9.11 v26.04,9 | IC1.8 71.8,9.26 v71.8,9
I2C0_SDA  (via drill 0.35)
  Top 0.173: D5.2 v52.9,17.2
  Route2 0.173: v71.18,9.56 71.18,11.76 69.87,13.07 54.62,13.07 53,14.69 v53,15.4 52.9,15.5 v52.9,17.2 52.9,17.54 51.3,19.14 37.38,19.14 27.89,9.65 v25.41,9.65 23.45,11.61 23.45,12.13 20.37,15.21 16.35,15.21 15.04,13.9 12.36,13.9 11.65,13.19 11.65,11.51 DSP.4
  Bottom 0.173: CON2.6 52.72,15.12 v53,15.4 | SDA0.TP 12.14,9.56 DSP.4 | IC2.9 25.66,9.65 v25.41,9.65 | IC1.9 v71.18,9.56
KEY_0  (via drill 0.35)
  Top 0.173: C7.1 19.49,13.6 | 19.49,13.6 19.49,12.59 R5.2 | R16.2 19.55,13.66 19.49,13.6 | 19.49,13.6 18.61,13.6 v18.53,13.68
  Route2 0.173: v49.25,12.82 49.46,13.02 49.46,15.39 48.87,15.98 43.9,15.98 41.03,13.11 37.91,13.11 37.85,13.17 32.73,13.17 26.93,7.37 23.76,7.37 21.79,9.34 19.68,9.34 18.53,10.49 v18.53,13.68
  Bottom 0.173: CON2.12 49.72,13.28 v49.25,12.82
KEY_1  (via drill 0.35)
  Top 0.173: C8.1 59.41,13.6 | 59.41,13.6 59.41,11.33 R6.2 59.33,10.16 v59.32,10.15 | R17.2 59.45,13.6 59.41,13.6
  Route2 0.173: v50.19,9.8 51.3,10.91 58.56,10.91 v59.32,10.15
  Bottom 0.173: CON2.11 50.22,9.83 v50.19,9.8
KEY_2  (via drill 0.35)
  Top 0.173: C9.1 R18.2 | R18.2 39.35,12.56 R12.2 | R18.2 38.18,13.7 v38.14,13.66
  Route2 0.173: v51.18,12.83 51.18,14.56 49.04,16.7 41.52,16.7 38.48,13.66 v38.14,13.66
  Bottom 0.173: CON2.10 50.72,13.28 v51.18,12.83
KEY_3  (via drill 0.35)
  Top 0.173: R13.2 102.67,13.4 | 102.67,13.4 C10.1 | R19.2 102.67,13.4 | 102.67,13.4 v102,13.4
  Route2 0.173: v51.16,9.84 56.75,4.25 98.01,4.25 102,8.24 v102,13.4
  Bottom 0.173: CON2.9 51.22,9.9 v51.16,9.84
LCD_BL  (via drill 0.35)
  Route2 0.173: v49.36,9.28 48.08,8 47.14,8 45.84,6.71 36.98,6.71 36.67,6.4 36.67,1.75 35.42,0.49 30.68,0.49 28.7,2.47 28.7,2.73 27.05,4.38 v24.36,4.38 24.36,5.89 21.27,8.98 16.62,8.98 15.34,7.7 5.34,7.7 v4.34,8.7
  Bottom 0.173: CON2.13 49.22,9.42 v49.36,9.28 | v4.34,8.7 4.15,8.51 2.87,8.51
  Bottom 0.203: R4.1 24.66,5.96
  Bottom 0.254: v24.36,4.38 24.3,4.44 T1.1 24.45,5.75 24.66,5.96
  Bottom 0.305: 2.87,8.51 2.87,8.31 BL.TP
LCD_CS  (via drill 0.35)
  Top 0.173: CON1.9 32.32,2.05 32.86,2.59 v32.9,2.59
  Route2 0.173: v46.08,9.89 44.72,8.53 35.32,8.53 33.89,7.1 33.89,3.58 v32.9,2.59
  Route15 0.173: v44.62,5.21 46.08,6.67 v46.08,9.89
  Bottom 0.173: CON2.19 46.22,10.03 v46.08,9.89 | CS.TP 44.62,5.13 v44.62,5.21
LCD_DC  (via drill 0.35)
  Top 0.173: CON1.10 31.88,1.46 31.88,2.15 32.14,2.41 v32.14,2.96
  Route2 0.173: v46.7,15.2 46.7,10.91 46.68,10.89 45.92,10.89 45.31,10.28 45.31,9.63 44.57,8.89 34.61,8.89 32.74,7.03 32.74,6.1 32.14,5.49 v32.14,2.96
  Bottom 0.173: CON2.18 46.72,15.18 v46.7,15.2
LCD_MISO  (via drill 0.35)
  Top 0.173: CON1.14 29.82,2.97 29.73,3.05 29.73,3.21 v29.34,3.6
  Route2 0.173: v29.34,3.6 29.75,3.2 29.75,3.06 30.17,2.64 30.17,2.36 31.31,1.22 35.12,1.22 35.94,2.05 35.94,6.7 36.68,7.44 45.54,7.44 46.84,8.73 47.26,8.73 48.06,9.54 48.06,9.69 v48.27,9.9
  Route15 0.173: v49.96,5.3 48.27,6.99 v48.27,9.9
  Bottom 0.173: CON2.15 48.22,9.95 v48.27,9.9 | MISO.TP 50.79,4.47 v49.96,5.3
LCD_MOSI  (via drill 0.35)
  Top 0.173: CON1.13 30.32,3.47 v30.26,3.53
  Route2 0.173: v47.7,15.2 v47.7,12.37 47.7,9.69 47.11,9.1 46.69,9.1 45.39,7.8 36.53,7.8 35.58,6.85 35.58,2.2 34.96,1.59 31.46,1.59 30.54,2.51 30.54,3.25 v30.26,3.53
  Route15 0.173: v48.49,5.62 47.7,6.41 v47.7,12.37
  Bottom 0.173: CON2.16 47.72,15.18 v47.7,15.2 | MOSI.TP 48.47,5.6 v48.49,5.62
LCD_RES  (via drill 0.35)
  Top 0.173: CON1.15 29.32,2.64 v29.25,2.7
  Route2 0.173: v29.25,2.7 31.1,0.86 35.27,0.86 36.31,1.9 36.31,6.55 36.83,7.07 45.69,7.07 46.99,8.37 47.41,8.37 48.39,9.35 48.5,9.35 48.82,9.67 48.82,11.38 48.7,11.5 v48.7,15.2
  Bottom 0.173: CON2.14 48.7,13.98 v48.7,15.2
LCD_SCLK  (via drill 0.35)
  Top 0.173: CON1.11 v31.32,2.54 v31.33,2.55
  Route2 0.173: v46.88,9.65 46.73,9.65 45.24,8.17 36.38,8.17 35.21,7 35.21,2.35 34.81,1.95 31.94,1.95 v31.34,2.55 v31.33,2.55
  Route15 0.173: v46.08,5.65 46.88,6.45 v46.88,9.65
  Bottom 0.173: CON2.17 47.22,10.03 46.9,9.71 46.9,9.67 v46.88,9.65 | SCK.TP 46.05,5.62 v46.08,5.65
MCP_LCD_RST  (via drill 0.35)
  Route2 0.173: v23.44,13.25 27.98,17.79 35.17,17.79 37.02,19.64 44.6,19.64 44.71,19.75 | 44.71,19.75 v44.73,19.77 | v69.03,13.62 54.97,13.62 53.87,14.72 53.87,17.79 52.16,19.5 44.96,19.5 44.71,19.75
  Route15 0.173: v44.73,19.77 45.7,18.8 v45.7,15.2
  Bottom 0.173: CON2.20 45.72,15.18 v45.7,15.2 | IC2.14 23.98,12.71 v23.44,13.25 | IC1.14 69.03,13.54 v69.03,13.62
N$1
  Bottom 0.173: 5.7,3.4 7.3,3.4 | 8.9,3.4 10.4,3.4 10.4,1.2 8.9,1.2 | 8.9,1.2 7.3,1.2 | 5.7,1.2 4.1,1.2 4.1,3.4 5.7,3.4 | 5.7,3.4 5.7,1.2 | 5.7,1.2 7.3,1.2 | 7.3,1.2 7.3,3.4 | 7.3,3.4 8.9,3.4 | 8.9,3.4 8.9,1.2
N$2  (via drill 0.35)
  Top 0.173: CON1.35 19.32,2.79 19.43,2.9 v19.49,2.9
  Route2 0.173: v19.8,8.11 19.8,3.21 v19.49,2.9
  Bottom 0.254: R2.2 19.77,8.08 v19.8,8.11
N$3  (via drill 0.35)
  Top 0.173: CON1.36 18.82,2.23 18.85,2.25 18.85,3.14 v18.7,3.29
  Route2 0.173: v18.53,8.09 18.53,3.46 v18.7,3.29
  Bottom 0.254: R3.2 v18.52,8.08 v18.53,8.09
N$4  (via drill 0.35)
  Bottom 0.254: R1.1 v21.04,8.14 v21.05,8.15 | R3.1 R2.1 21.04,7.12 R1.1 | R1.1 22.72,7.17 T1.3
N$5  (via drill 0.35)
  Top 0.254: CON1.34 19.85,1.43 19.85,2.26 20.38,2.78 v20.38,3.17
  Route2 0.173: v20.38,3.17 v20.39,3.18 20.39,4.67 v20.67,4.95
  Bottom 0.173: R1.2 21.04,5.32 v20.67,4.95
N$6
  Route15 0.173: 5.7,3.4 7.3,3.4 | 8.9,3.4 10.4,3.4 10.4,1.2 8.9,1.2 | 8.9,1.2 7.3,1.2 | 5.7,1.2 4.1,1.2 4.1,3.4 5.7,3.4 | 5.7,3.4 5.7,1.2 | 5.7,1.2 7.3,1.2 | 7.3,1.2 7.3,3.4 | 7.3,3.4 8.9,3.4 | 8.9,3.4 8.9,1.2
N$7  (via drill 0.35)
  Top 0.173: D2.C 32.33,11.45 v31.9,11.45 <.4 | R16.1 21.3,13.25 <.3 21.3,10.4 v21.2,10.3
  Route15 0.173: v21.2,10.3 21.25,10.35 30.8,10.35 v31.9,11.45
N$8
  Bottom 0.173: IC2.17 24.4,15.73 24.4,16.26 R14.D1
N$9
  Bottom 0.173: IC2.18 24.9,16.15 24.9,16.89 R14.C1
N$10
  Bottom 0.173: IC2.19 25.4,16.57 25.4,17.52 R14.B1
N$11
  Bottom 0.173: IC2.20 25.9,16.99 25.9,18.15 R14.A1
N$12
  Bottom 0.173: IC2.21 28.1,18.15 28.1,19.18 R15.D1
N$13
  Bottom 0.173: R15.C1 28.8,18.75 28.8,17.39 IC2.22
N$14
  Bottom 0.173: IC2.23 29.3,16.97 29.3,18.12 R15.B1
N$15
  Bottom 0.173: IC2.24 29.9,16.65 29.9,17.59 R15.A1
N$16  (via drill 0.35)
  Top 0.173: SEL1.A v6.6,24.4
  Route2 0.173: v6.6,24.4 7.6,25.4 14.8,25.4 v21.6,18.6
  Bottom 0.173: R14.D2 22.06,18.6 v21.6,18.6
N$17  (via drill 0.35)
  Top 0.173: SEL2.A 15.93,24.6 v16.7,24.6
  Route2 0.173: v16.7,24.6 22,19.3 v22.3,19.3
  Bottom 0.173: R14.C2 22.49,19.3 v22.3,19.3
N$18  (via drill 0.35)
  Top 0.173: SEL3.A v26.9,24.5
  Route2 0.173: v26.9,24.5 24.6,24.5 22.2,22.1 22.2,20.9 v23.1,20
  Bottom 0.173: R14.B2 23.1,19.82 v23.1,20
N$19  (via drill 0.35)
  Top 0.173: SEL4.A 36.8,24.5 v36.9,24.6
  Route2 0.173: v23.8,20.7 23.1,21.4 23.1,21.9 24.9,23.7 33.5,23.7 34.4,24.6 v36.9,24.6
  Bottom 0.173: R14.A2 23.8,20.25 v23.8,20.7
N$20  (via drill 0.35)
  Top 0.173: SEL5.A v47.15,24.49
  Route15 0.173: v30.2,21.7 36.7,21.7 38.83,23.83 46.49,23.83 v47.15,24.49
  Bottom 0.173: R15.D2 30.2,21.28 v30.2,21.7
N$21  (via drill 0.35)
  Top 0.173: SEL6.A 57.11,24.49 v57.2,24.4
  Route15 0.173: v30.9,21 36.53,21 38.99,23.45 56.25,23.45 v57.2,24.4
  Bottom 0.173: R15.C2 30.9,20.85 v30.9,21
N$22  (via drill 0.35)
  Top 0.173: SEL7.A 66.44,24.5 v67.29,24.5
  Route15 0.173: v67.29,24.5 65.87,23.08 39.14,23.08 36.37,20.3 v31.6,20.3
  Bottom 0.173: R15.B2 31.48,20.3 v31.6,20.3
N$23  (via drill 0.35)
  Top 0.173: SEL8.A 77.37,24.47 v77.4,24.5
  Route2 0.173: v73.1,23.8 73.8,24.5 v77.4,24.5
  Route15 0.173: v32.3,19.6 36.2,19.6 39.3,22.7 72,22.7 v73.1,23.8
  Bottom 0.173: R15.A2 31.91,19.6 v32.3,19.6
N$24  (via drill 0.35)
  Top 0.173: R18.1 41.32,13.03 O.3 41.32,10.48 v41.34,10.46 | D3.C 51.68,10.92 50.96,11.64 O.4 50.21,11.85 v50.21,12.79
  Route15 0.173: v41.34,10.46 41.34,13.31 41.61,13.58 49.45,13.58 50.23,12.8 v50.21,12.79
N$25  (via drill 0.35)
  Top 0.173: R19.1 104.74,13.49 PWR.4 v106.34,15.82 | v112.24,15.79 112.27,15.82 PWR.3 115.86,15.82 D4.C
  Route15 0.173: v112.24,15.79 106.37,15.79 v106.34,15.82
N$26  (via drill 0.35)
  Top 0.173: R17.1 60.85,12.3 61.08,12.08 | 61.08,12.08 >.3 | >.4 68.83,11.67 v68.5,12 | 61.08,12.08 60.8,11.8 60.8,11.6 60.92,11.48 v60.92,10.39 D1.C
  Route2 0.173: v60.92,10.39 61.09,10.39 62.57,11.87 68.37,11.87 v68.5,12
N$27
  Route2 0.173: 5.7,3.4 7.3,3.4 | 8.9,3.4 10.4,3.4 10.4,1.2 8.9,1.2 | 8.9,1.2 7.3,1.2 | 5.7,1.2 4.1,1.2 4.1,3.4 5.7,3.4 | 5.7,3.4 5.7,1.2 | 5.7,1.2 7.3,1.2 | 7.3,1.2 7.3,3.4 | 7.3,3.4 8.9,3.4 | 8.9,3.4 8.9,1.2
N$28
  Top 0.173: 5.7,3.4 7.3,3.4 | 8.9,3.4 10.4,3.4 10.4,1.2 8.9,1.2 | 8.9,1.2 8.9,3.4 | 8.9,3.4 7.3,3.4 | 7.3,3.4 7.3,1.2 5.7,1.2 5.7,3.4 | 5.7,3.4 4.1,3.4 4.1,1.2 8.9,1.2
N$46  (via drill 0.35)
  Top 0.173: R10.1 90.89,14.7 v90.1,14.7
  Route2 0.173: v77.47,15.95 88.84,15.95 v90.1,14.7
  Bottom 0.173: IC1.26 76.66,15.95 v77.47,15.95
N$47  (via drill 0.35)
  Top 0.173: R7.1 90.14,7.04 v90.1,7
  Route2 0.173: v77.98,15.22 88.28,15.22 90.1,13.39 v90.1,7
  Bottom 0.173: IC1.27 76.97,15.34 77.86,15.34 v77.98,15.22
N$48  (via drill 0.35)
  Top 0.173: R11.1 90.05,22.75 v90,22.7
  Route2 0.173: v76.83,16.59 87.97,16.59 90,18.62 v90,22.7
  Bottom 0.173: IC1.25 76.38,16.59 v76.83,16.59
N$50
  Bottom 0.173: IC1.17 69.35,16.52 R8.D1
N$51
  Bottom 0.173: IC1.18 69.72,17.07 R8.C1
N$52
  Bottom 0.173: IC1.19 70.28,17.42 R8.B1
N$53
  Bottom 0.173: IC1.20 71.09,17.53 71.09,17.67 70.85,17.91 R8.A1
N$54
  Bottom 0.173: IC1.21 74.62,19.05 R9.D1
N$55
  Bottom 0.173: IC1.22 74.94,17.91 74.94,17.97 75.19,18.21 R9.C1
N$56
  Bottom 0.173: IC1.23 75.75,17.8 R9.B1
N$57
  Bottom 0.173: IC1.24 76.25,17.39 R9.A1
N$58  (via drill 0.35)
  Top 0.173: CH1.A 6.49,26.71 v6.6,26.6
  Route2 0.173: v6.6,26.6 7.1,26.1 15.6,26.1 16.53,25.17 60.03,25.17 v67,18.2
  Bottom 0.173: R8.D2 67.47,18.2 v67,18.2
N$59  (via drill 0.35)
  Top 0.173: CH2.A v16.69,26.69 v16.7,26.7
  Route2 0.173: v67.7,18.8 66.93,18.8 60.19,25.54 17.86,25.54 v16.7,26.7
  Bottom 0.173: R8.C2 68,18.8 v67.7,18.8
N$60  (via drill 0.35)
  Top 0.173: CH3.A 26.81,26.69 v26.9,26.6
  Route2 0.173: v26.9,26.6 27.58,25.92 60.35,25.92 66.67,19.6 v68.5,19.6
  Bottom 0.173: R8.B2 68.5,19.43 v68.5,19.6
N$61  (via drill 0.35)
  Top 0.173: CH4.A 36.91,26.69 v37,26.6
  Route2 0.173: v69.2,20.3 66.5,20.3 60.5,26.3 37.3,26.3 v37,26.6
  Bottom 0.173: R8.A2 69.2,19.86 v69.2,20.3
N$62  (via drill 0.35)
  Top 0.173: v47.1,27.1 46.57,27.1 CH5.A
  Route15 0.173: v47.1,27.1 49.1,25.1 73.1,25.1 76.36,21.84 v76.36,21.11
  Bottom 0.173: R9.D2 76.36,20.83 v76.36,21.11
N$63  (via drill 0.35)
  Top 0.173: CH6.A 56.34,26.94 56.5,27.1 v57.3,27.1
  Route15 0.173: v57.3,27.1 58.92,25.48 73.32,25.48 77,21.8 v77,20.5
  Bottom 0.173: R9.C2 77,20.33 v77,20.5
N$64  (via drill 0.35)
  Top 0.173: CH7.A 66.86,27.08 67.38,27.08 v67.4,27.1
  Route15 0.173: v77.7,19.8 77.9,20 77.9,21.5 73.55,25.85 68.65,25.85 v67.4,27.1
  Bottom 0.173: R9.B2 77.6,19.8 v77.7,19.8
N$65  (via drill 0.35)
  Top 0.173: v77.5,27.2 76.86,27.2 76.54,26.88 CH8.A
  Route15 0.173: v77.5,27.2 75.8,25.5 75.8,24.13 78.6,21.33 78.6,19.4 v78.3,19.1
  Bottom 0.173: R9.A2 78.03,19.1 v78.3,19.1
N$66
  Top 0.2: R11.2 92.27,24.46 LED3.A
N$67
  Top 0.173: R10.2 92.25,16.37 LED2.A
N$68
  Top 0.173: R7.2 LED1.A

### Text on the board
Top: 1
Route2: 2
Route15: 3
Bottom: 4
bPlace: github.com/DvidMakesThings/HW_10-In-Rack_PDU